# Altium schematic sheet Camera_Shield_Camera_SDCARD.SchDoc
size B
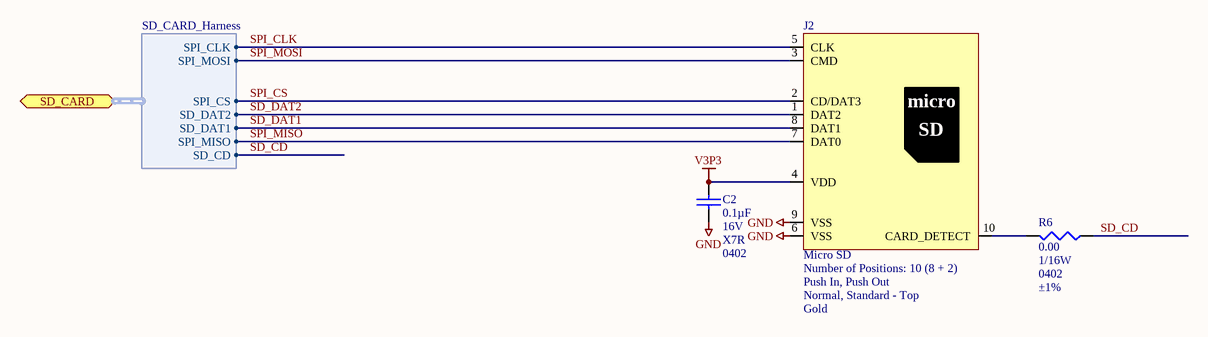
[diagram p0: Camera_Shield_Camera_SDCARD.SchDoc]

## Parts
C2  Capacitance: 0.1µF  Voltage - Rated: 16V  Temperature Coefficient: X7R  Package / Case: 0402  [C_ERA-0402]  (hidden comment: C_0402_0.1UF_16V)
J2  Micro SD  Number of Positions: 10 (8 + 2)  Insertion, Removal Method: Push In, Push Out  Mounting Feature: Normal, Standard - Top  Contact Finish: Gold  [MICRO SD]
R6  Resistance In Ohms: 0.00  Power (Watts): 1/16W  Case: 0402  Tolerance: ±1%  [ERA-0402]  (hidden comment: R_0402_0.0)

## Ports
SD_CARD (harness SD_CARD_Harness)

## Harnesses
SD_CARD_Harness: SPI_CLK, SPI_MOSI, SPI_CS, SD_DAT2, SD_DAT1, SPI_MISO, SD_CD

## Nets
GND: C2.1 J2.6(VSS) J2.9(VSS)
V3P3: C2.2 J2.4(VDD)
SD_CD: R6.2 ; port SD_CARD.SD_CD
SD_DAT1: J2.8(DAT1) ; port SD_CARD.SD_DAT1
SD_DAT2: J2.1(DAT2) ; port SD_CARD.SD_DAT2
SPI_CLK: J2.5(CLK) ; port SD_CARD.SPI_CLK
SPI_CS: J2.2(CD/DAT3) ; port SD_CARD.SPI_CS
SPI_MISO: J2.7(DAT0) ; port SD_CARD.SPI_MISO
SPI_MOSI: J2.3(CMD) ; port SD_CARD.SPI_MOSI
NetJ2_10: J2.10(CARD_DETECT) R6.1

## Notes on the sheet
- Title:
- http://www.cospandesign.com
- Cospan Design
- Project:
- Document:
- Engineer:
- Drawn By:
- Approved By:
- Revision:
- Date:
- Number:
- of
- (in symbol J_MICRO_SD) micro; SD

## Library data of the parts
C2 = C_0402_0.1UF_16V: CAP CER .10UF 16V X7R 0402; Manufacturer: TDK Corporation; Manufacturer Part Number: C1005X7R1C104K; Tolerance: ±10%; Supplier 1: Digi-Key; Supplier Part Number 1: 445-4952-1-ND; RoHS: RoHS Compliant; Category: Capacitors; Stock 1: 230800; Pricing: 10=0.024, 100=0.0143, 500=0.00826, 1000=0.00572 (USD); Mounting Type: Surface Mount, MLCC; Features: General Purpose; Lead Spacing: -; Thickness: 0.50mm; Packaging: Cut Tape (CT); ComponentLink1URL: http://www.tdk.co.jp/tefe02/e412_c.pdf; ComponentLink1Description: http://www.tdk.co.jp/tefe02/e412_c.pdf; Operating Temperature: -55°C ~ 125°C
J2 = J_MICRO_SD: CONN MICRO SD R/A PUSH-PUSH SMD; Manufacturer: Molex Inc; Manufacturer Part Number: 502570-0893; Card Type: Secure Digital - microSD™ TransFlash; Connector Type: Connector and Ejector; Supplier 1: Digi-Key; Supplier Part Number 1: WM19093CT-ND; RoHS: RoHS Compliant; Category: Connectors, Interconnects; Stock 1: 9524; Pricing: 1=2.93, 25=2.5456, 50=2.2908, 100=2.0363, 250=1.8512, 500=1.72394 (USD); Ejector Side: -; Mounting Type: Surface Mount, Right Angle; Features: Switch; Height Above Board: 0.071" (1.80mm); Packaging: Cut Tape (CT); Contact Finish Thickness: 20µin (0.51µm); ComponentLink1URL: http://www.molex.com/pdm_docs/sd/5025700893_sd.pdf; ComponentLink1Description: http://www.molex.com/pdm_docs/sd/5025700893_sd.pdf
R6 = R_0402_0.00: RES 1.00 OHM 1/16W 1% 0402 SMD; Manufacturer: Panasonic - ECG; Manufacturer Part Number: ERJ-2GE0R00X; Description: RES 0.0 OHM 1/10W 0402 SMD; Resistance (Ohms): 0.0; Temperature Coefficient: -100/ +600ppm/°C; Supplier 1: Digi-Key; Supplier Part Number 1: P0.0JDKR-ND; RoHS: RoHS Compliant; Category: Resistors; Stock 1: 22504755; Pricing: 1=0.05, 50=0.0172, 100=0.0131, 250=0.00976, 500=0.0072, 1000=0.0048, 5000=0.00338 (USD); Composition: Thick Film; Features: -; Size / Dimension: 0.039" L x 0.020" W (1.00mm x 0.50mm); Height: 0.014" (0.35mm); Lead Style: Surface Mount (SMD - SMT); Packaging: Digi-Reel®; Package / Case: 0402 (1005 Metric); ComponentLink1URL: http://industrial.panasonic.com/www-cgi/jvcr13pz.cgi?E+PZ+3+AOA0001+ERJ2GE0R00X+7+WW; ComponentLink1Description: http://industrial.panasonic.com/www-cgi/jvcr13pz.cgi?E+PZ+3+AOA0001+ERJ2GE0R00X+7+WW